# Altium schematic sheet IOs.SchDoc
size A4; SheetNumber: 3; SheetTotal: 5
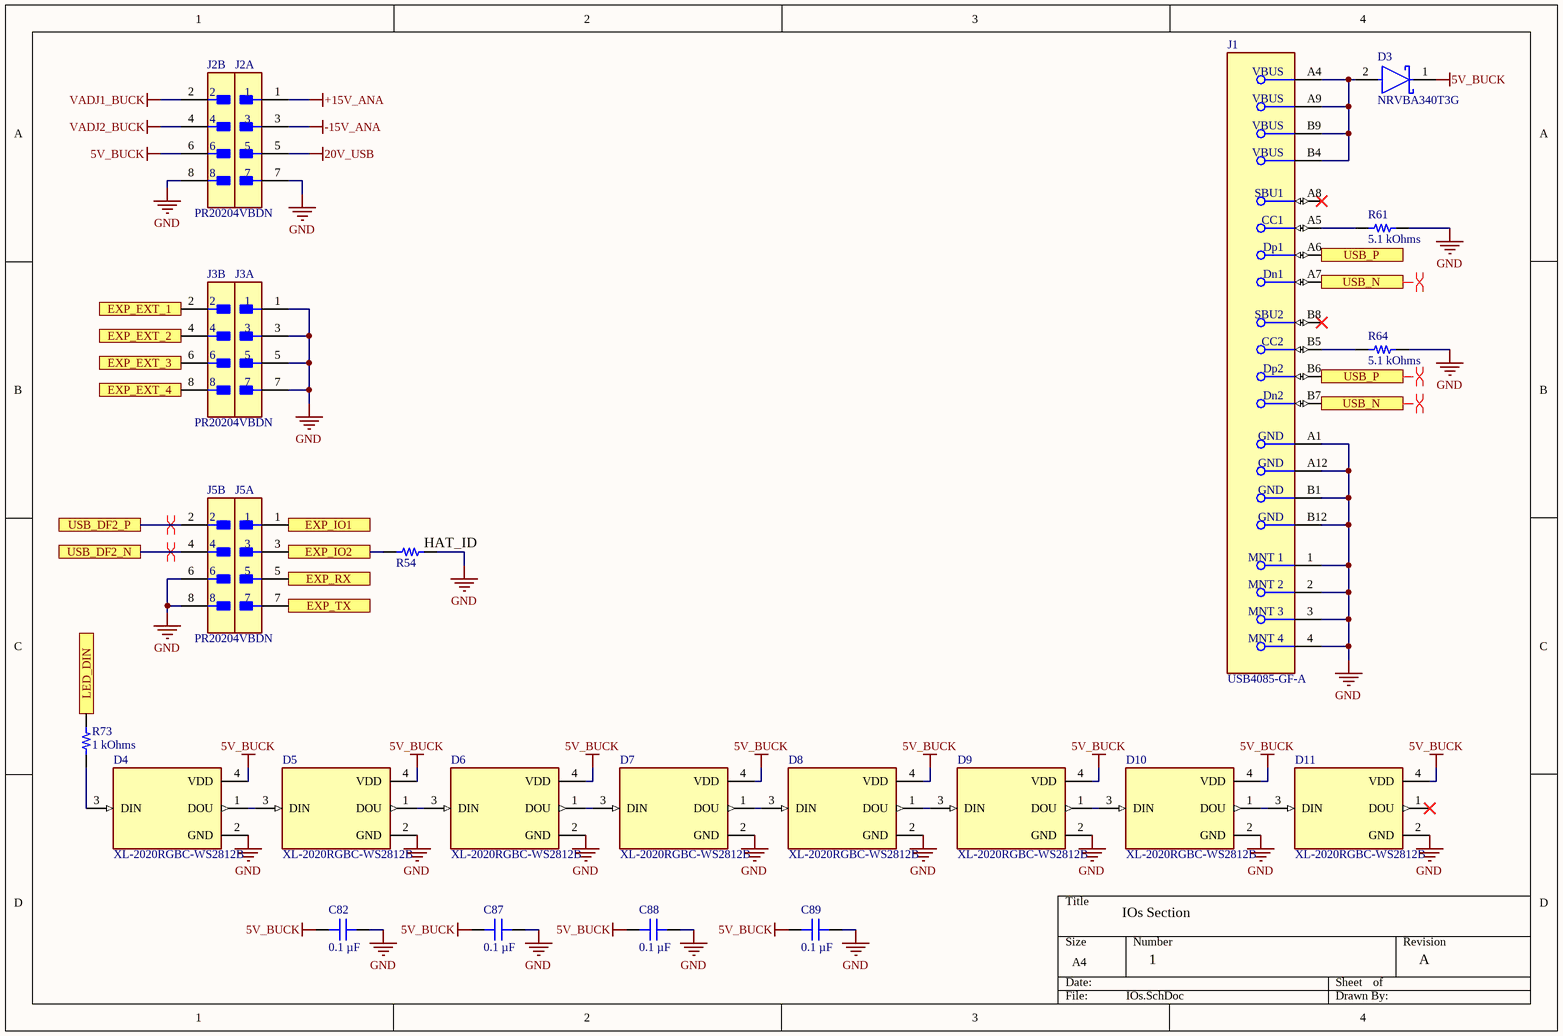
[diagram p0: IOs.SchDoc]

## Parts
C82  0.1 µF  [CAP 0603_1608]
C87  0.1 µF  [CAP 0603_1608]
C88  0.1 µF  [CAP 0603_1608]
C89  0.1 µF  [CAP 0603_1608]
D3  NRVBA340T3G  [FP-403D-MFG]
D4  XL-2020RGBC-WS2812B  [LED_XL-2020RGBC-WS2812B]
D5  XL-2020RGBC-WS2812B  [LED_XL-2020RGBC-WS2812B]
D6  XL-2020RGBC-WS2812B  [LED_XL-2020RGBC-WS2812B]
D7  XL-2020RGBC-WS2812B  [LED_XL-2020RGBC-WS2812B]
D8  XL-2020RGBC-WS2812B  [LED_XL-2020RGBC-WS2812B]
D9  XL-2020RGBC-WS2812B  [LED_XL-2020RGBC-WS2812B]
D10  XL-2020RGBC-WS2812B  [LED_XL-2020RGBC-WS2812B]
D11  XL-2020RGBC-WS2812B  [LED_XL-2020RGBC-WS2812B]
J1  USB4085-GF-A  [FP-USB4085-GF-A-MFG]
J2  PR20204VBDN  [FP-PR20204VBDN-MFG]  (parts A,B of 2)
J3  PR20204VBDN  [FP-PR20204VBDN-MFG]  (parts A,B of 2)
J5  PR20204VBDN  [FP-PR20204VBDN-MFG]  (parts A,B of 2)
R54  0 Ohms  [RES 0603_1608]  (value not drawn)
R61  5.1 kOhms  [RES 0603_1608]
R64  5.1 kOhms  [RES 0603_1608]
R73  1 kOhms  [RES 0603_1608]

## Ports
EXP_EXT_1, EXP_EXT_2, EXP_EXT_3, EXP_EXT_4, EXP_IO1, EXP_IO2, EXP_RX, EXP_TX, LED_DIN, USB_DF2_N, USB_DF2_P, USB_N, USB_P

## Nets
5V_BUCK: C82.2 C87.2 C88.2 C89.2 D3.1(C) D4.4(VDD) D5.4(VDD) D6.4(VDD) D7.4(VDD) D8.4(VDD) D9.4(VDD) D10.4(VDD) D11.4(VDD) J2.6
20V_USB: J2.5
+15V_ANA: J2.1
-15V_ANA: J2.3
GND: C82.1 C87.1 C88.1 C89.1 D4.2(GND) D5.2(GND) D6.2(GND) D7.2(GND) D8.2(GND) D9.2(GND) D10.2(GND) D11.2(GND) J1.1(MNT_1) J1.2(MNT_2) J1.3(MNT_3) J1.4(MNT_4) J1.A1(GND) J1.A12(GND) J1.B1(GND) J1.B12(GND) J2.7 J2.8 J3.1 J3.3 J3.5 J3.7 J5.6 J5.8 R54.1 R61.2 R64.2
VADJ1_BUCK: J2.2
VADJ2_BUCK: J2.4
EXP_EXT_1: J3.2 ; port EXP_EXT_1
EXP_EXT_2: J3.4 ; port EXP_EXT_2
EXP_EXT_3: J3.6 ; port EXP_EXT_3
EXP_EXT_4: J3.8 ; port EXP_EXT_4
EXP_IO1: J5.1 ; port EXP_IO1
EXP_IO2: J5.3 R54.2 ; port EXP_IO2
EXP_RX: J5.5 ; port EXP_RX
EXP_TX: J5.7 ; port EXP_TX
LED_DIN: R73.2 ; port LED_DIN
USB_DF2_N: J5.4 ; port USB_DF2_N
USB_DF2_P: J5.2 ; port USB_DF2_P
USB_N: J1.A7(Dn1) J1.B7(Dn2) ; port USB_N
USB_P: J1.A6(Dp1) J1.B6(Dp2) ; port USB_P
NetD3_2: D3.2(A) J1.A4(VBUS) J1.A9(VBUS) J1.B4(VBUS) J1.B9(VBUS)
NetD4_1: D4.1(DOU) D5.3(DIN)
NetD4_3: D4.3(DIN) R73.1
NetD5_1: D5.1(DOU) D6.3(DIN)
NetD6_1: D6.1(DOU) D7.3(DIN)
NetD7_1: D7.1(DOU) D8.3(DIN)
NetD8_1: D8.1(DOU) D9.3(DIN)
NetD9_1: D9.1(DOU) D10.3(DIN)
NetD10_1: D10.1(DOU) D11.3(DIN)
NetJ1_A5: J1.A5(CC1) R61.1
NetJ1_B5: J1.B5(CC2) R64.1

Not connected (* = marked no-connect by the designer): D11 1(DOU)*; J1 A8(SBU1)* B8(SBU2)*

## Layout directives
differential pair; differential pair class USB: USB_DF2_N, USB_DF2_P, USB_N, USB_P

## Notes on the sheet
- (near R54) HAT_ID
- IOs Section
- 1
- A

## Library data of the parts
C82 C87-C89 = C0603C104M5RACTU: SMT Capacitor; manufacturer: KEMET; Temperature Coefficient: X7R; Tolerance: ±20%; Voltage - Rated: 50V; Part Number: C0603C104M5RACTU; value: 0.1 µF; Applications: Bypass, Decoupling; Capacitance: 0.1 µF; componentlink1description: Datasheet; componentlink1url: https://api.kemet.com/component-edge/download/datasheet/C0603C104M5RACTU.pdf; componentlink2description: DigiKey Link; componentlink2url: https://www.digikey.com/en/products/detail/kemet/C0603C104M5RACTU/2199782; Device Package: 0603 (1608 Metric); lastupdated: 06/04/2026 19:22:47; Lifecycle Status: Active; Minimum Order: 1; Mounting Type: Surface Mount, MLCC; Operating Temperature: -55°C ~ 125°C; Package / Case: 0603 (1608 Metric); packaging: CutTape; partid: 69106; Part Status: Active; price: 0.01; series: SMD Comm X7R; Size / Dimension: 0.063" L x 0.031" W (1.60mm x 0.80mm); Supplier 1: DigiKey; Supplier Part Number 1: 399-C0603C104M5RACTUCT-ND; Thickness (Max): 0.034" (0.87mm)
D3 = CMP-1055-00307-2: DIODE SCHOTTKY 40V 3A SMA; Peak Non-Repetitive Surge Current: 100A; Max Reverse Current: 15mA; Forward Voltage: 450mV; Element Configuration: Single; Radiation Hardening: No; Max Operating Temperature: 150°C; Min Operating Temperature: -55°C; Package Quantity: 5000; Lead Free: Lead Free; Average Rectified Current: 3A; REACH SVHC: No SVHC; RoHS Compliant: Yes; Number of Pins: 2; Length: 4.57mm; Halogen Free: Halogen Free; Packaging: Tape and Reel; Height: 2.05mm; Max Repetitive Reverse Voltage (Vrrm): 40V; Series: -; Case/Package: SMA; Max Reverse Voltage (DC): 40V; Width: 2.92mm; Max Forward Surge Current (Ifsm): 100A; Forward Current: 3A; Weight: 0.003739oz
D4-D11 = XL-2020RGBC-WS2812B: 2020 RGB LED(BUILT-IN IC); MF: XINGLIGHT; SnapEDA_Link: https://www.snapeda.com/parts/XL-2020RGBC-WS2812B/Xinglight/view-part/?ref=snap; Package: None; Value: *; MP: XL-2020RGBC-WS2812B; Check_prices: https://www.snapeda.com/parts/XL-2020RGBC-WS2812B/Xinglight/view-part/?ref=eda
J1 = CMP-196119-000001-2: CONN RCPT USB2.0 TYPE C 24POS RA; Gender: Receptacle; Number of Positions: 16; USB Standard: USB 2.0; Orientation: Right Angle; Contact Plating: Gold; Contact Material: Copper Alloy
J2 J3 J5 = CMP-77940-000004-1: PIN HEADER, THR, DUAL ROW, .100"
R54 = WSL060300000ZEA9: RES 0 OHM JUMPER 0603; Manufacturer: Vishay Dale; Temperature Coefficient: ±3900ppm/°C; Part Number: WSL060300000ZEA9; ComponentLink1Description: Datasheet; ComponentLink1URL: http://www.vishay.com/docs/30192/wsl-9.pdf; ComponentLink2Description: DigiKey Link; ComponentLink2URL: https://www.digikey.com/en/products/detail/vishay-dale/WSL060300000ZEA9/7423217; Composition: Metal Element; Device Package: 0603 (1608 Metric); Height - Seated (Max): 0.021" (0.53mm); LastUpdated: 09/02/2024 20:43:09; Lifecycle Status: Active; Minimum Order: 1; Number of Terminations: 2; Operating Temperature: -65°C ~ 170°C; Package / Case: 0603 (1608 Metric); Packaging: TapeAndReel; PartId: 11865; Part Status: Active; Price: 0.39; Resistance: 0 Ohms; Series: WSL; Size / Dimension: 0.060" L x 0.030" W (1.52mm x 0.76mm); Supplier 1: DigiKey; Supplier Part Number 1: 541-3927-1-ND; Supplier Device Package: 0603; Tolerance: Jumper; Value: 0 Ohms
R61 R64 = ERJ-PA3F5101V: RES SMD 5.1K OHM 1% 1/3W 0603; Manufacturer: Panasonic Electronic Components; Power (Watts): 0.333W 1/3W; Temperature Coefficient: ±100ppm/°C; ComponentLink1Description: Datasheet; ComponentLink1URL: https://industrial.panasonic.com/cdbs/www-data/pdf/RDO0000/AOA0000C331.pdf; ComponentLink2Description: DigiKey Link; ComponentLink2URL: https://www.digikey.com/en/products/detail/panasonic-electronic-components/ERJ-PA3F5101V/5035934; Composition: Thick Film; Device Package: 0603 (1608 Metric); Features: Automotive AEC-Q200 Pulse Withstanding; Height - Seated (Max): 0.022\ (0.55mm); LastUpdated: 2024-02-09 20:42:57.823000; Lifecycle Status: Active; Part Number: ERJ-PA3F5101V; Minimum Order: 1; Number of Terminations: 2; Operating Temperature: -55°C ~ 155°C; Package / Case: 0603 (1608 Metric); Packaging: TapeAndReel; PartId: 14704; Part Status: Active; Price: 0.01; Ratings: AEC-Q200; Resistance: 5.1 kOhms; Series: ERJ-PA3; Size / Dimension: 0.063\ L x 0.031\ W (1.60mm x 0.80mm); Supplier 1: DigiKey; Supplier Part Number 1: P5.1KBYCT-ND; Supplier Device Package: 0603; Tolerance: ±1%; Value: 5.1 kOhms
R73 = ERJ-PA3F1001V: RES SMD 1K OHM 1% 1/3W 0603; Manufacturer: Panasonic Electronic Components; Power (Watts): 0.333W 1/3W; Temperature Coefficient: ±100ppm/°C; ComponentLink1Description: Datasheet; ComponentLink1URL: https://industrial.panasonic.com/cdbs/www-data/pdf/RDO0000/AOA0000C331.pdf; ComponentLink2Description: DigiKey Link; ComponentLink2URL: https://www.digikey.com/en/products/detail/panasonic-electronic-components/ERJ-PA3F1001V/5035848; Composition: Thick Film; Device Package: 0603 (1608 Metric); Features: Automotive AEC-Q200 Pulse Withstanding; Height - Seated (Max): 0.022\ (0.55mm); LastUpdated: 2024-02-09 20:42:57.220000; Lifecycle Status: Active; Part Number: ERJ-PA3F1001V; Minimum Order: 1; Number of Terminations: 2; Operating Temperature: -55°C ~ 155°C; Package / Case: 0603 (1608 Metric); Packaging: TapeAndReel; PartId: 14885; Part Status: Active; Price: 0.01; Ratings: AEC-Q200; Resistance: 1 kOhms; Series: ERJ-PA3; Size / Dimension: 0.063\ L x 0.031\ W (1.60mm x 0.80mm); Supplier 1: DigiKey; Supplier Part Number 1: P1.0KBYCT-ND; Supplier Device Package: 0603; Tolerance: ±1%; Value: 1 kOhms